# Altium project 22.99 TPF G2.PrjPcb
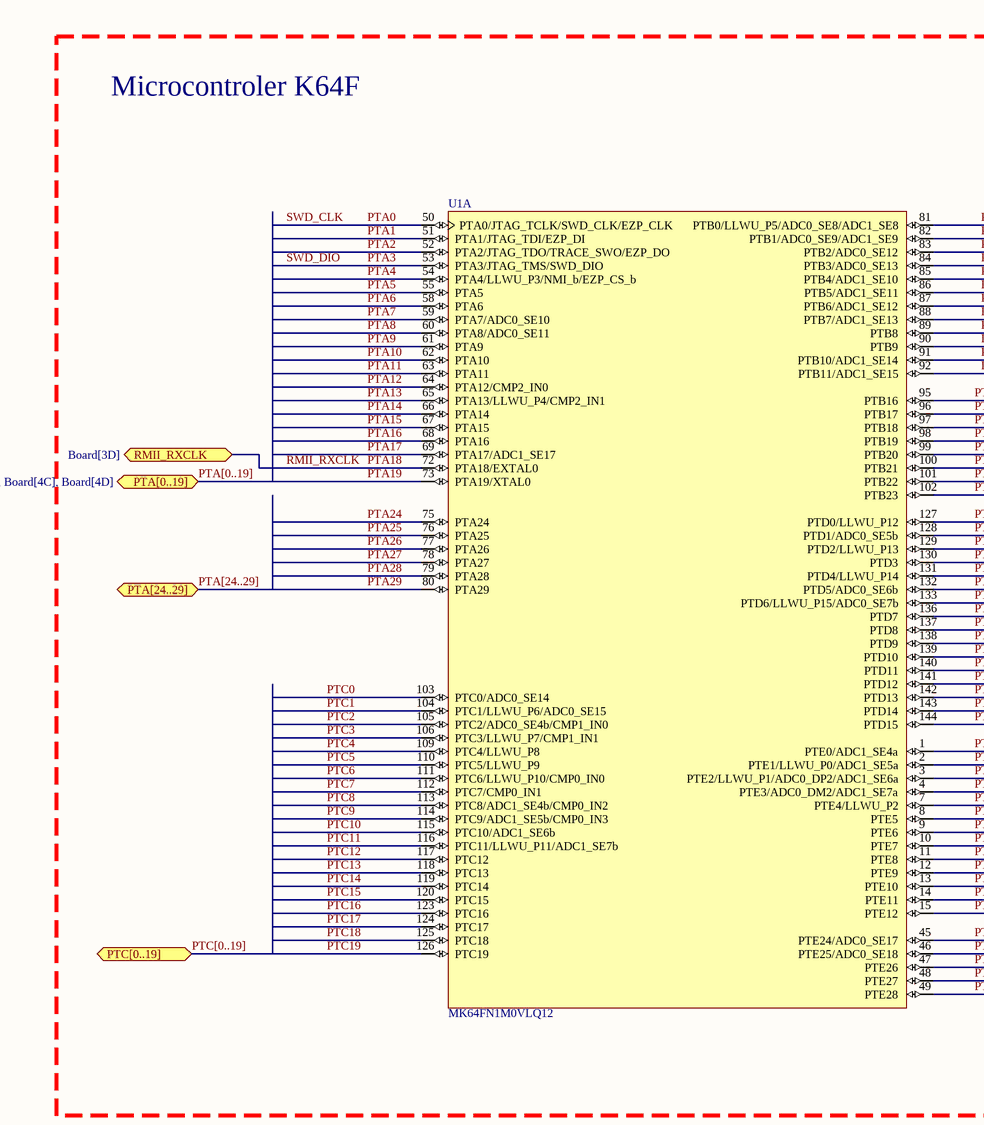
[diagram p0: Board.SchDoc, top left]
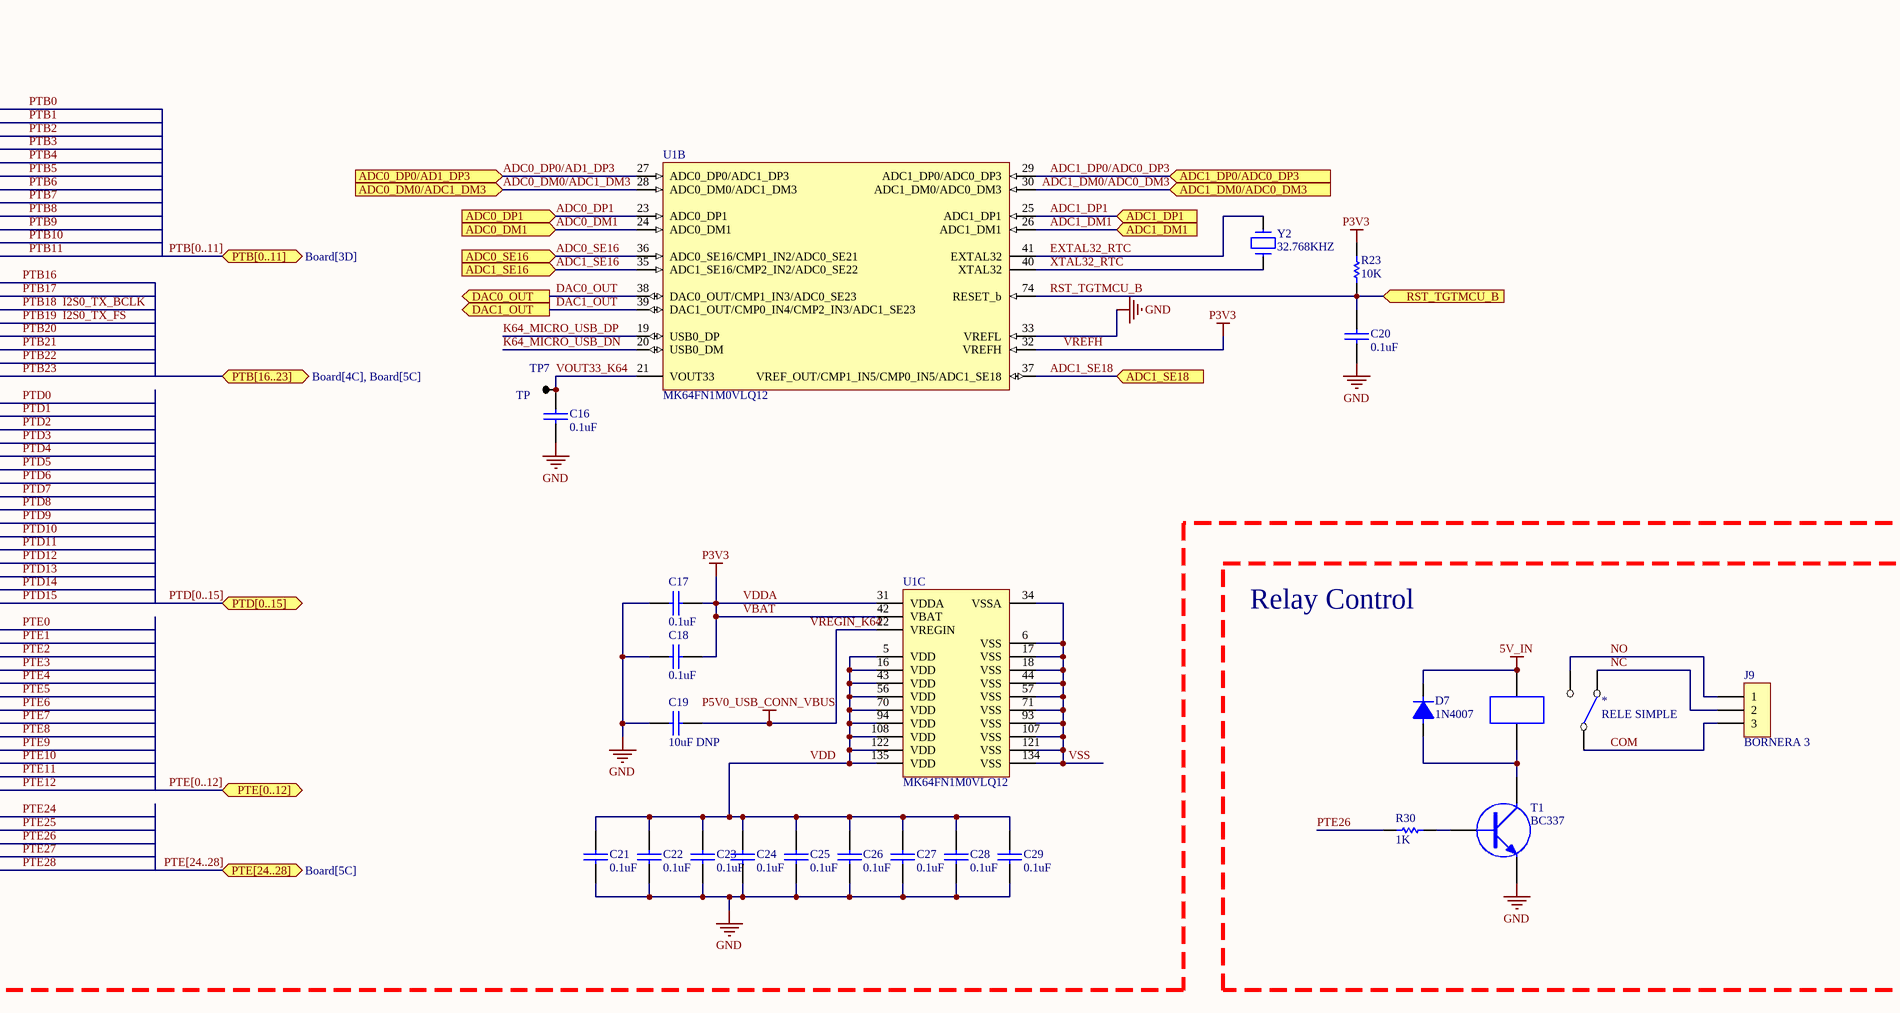
[diagram p1: Board.SchDoc, top right]
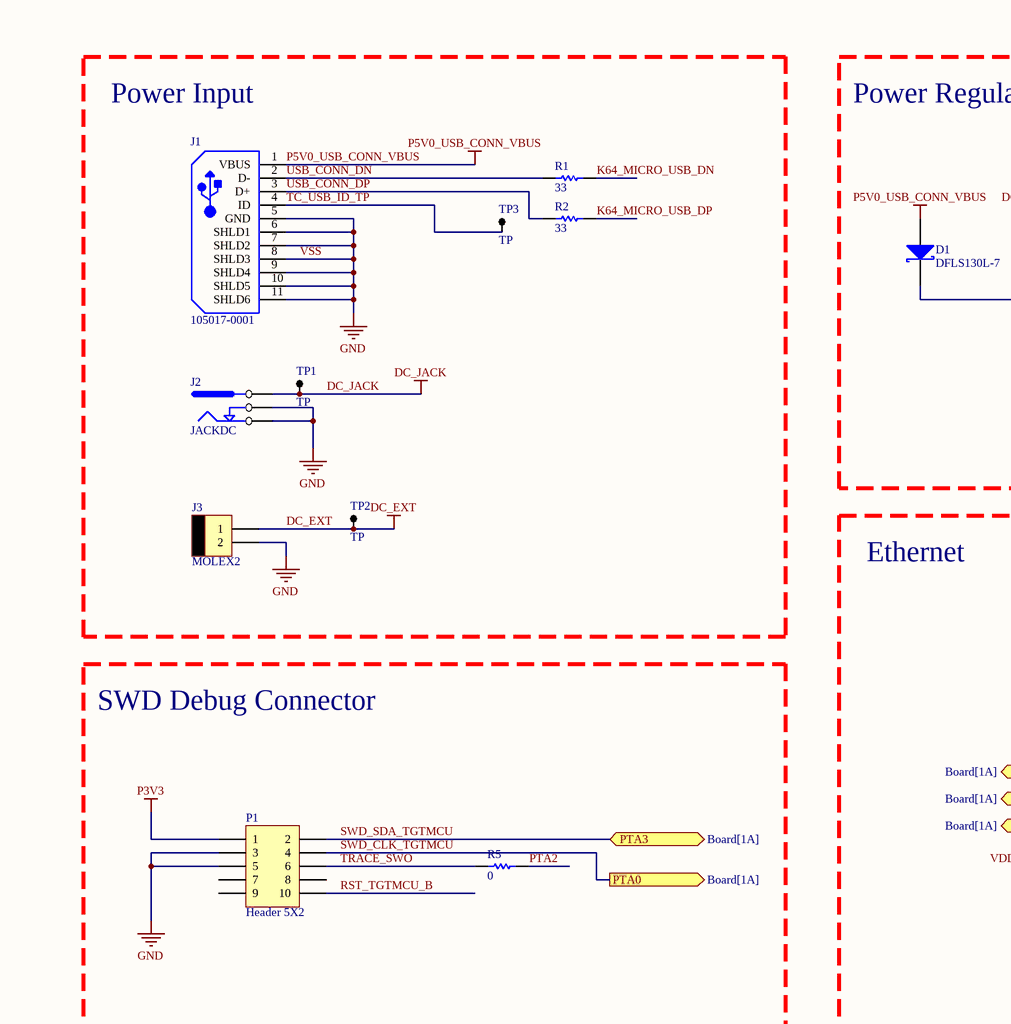
[diagram p2: Board.SchDoc, bottom left]
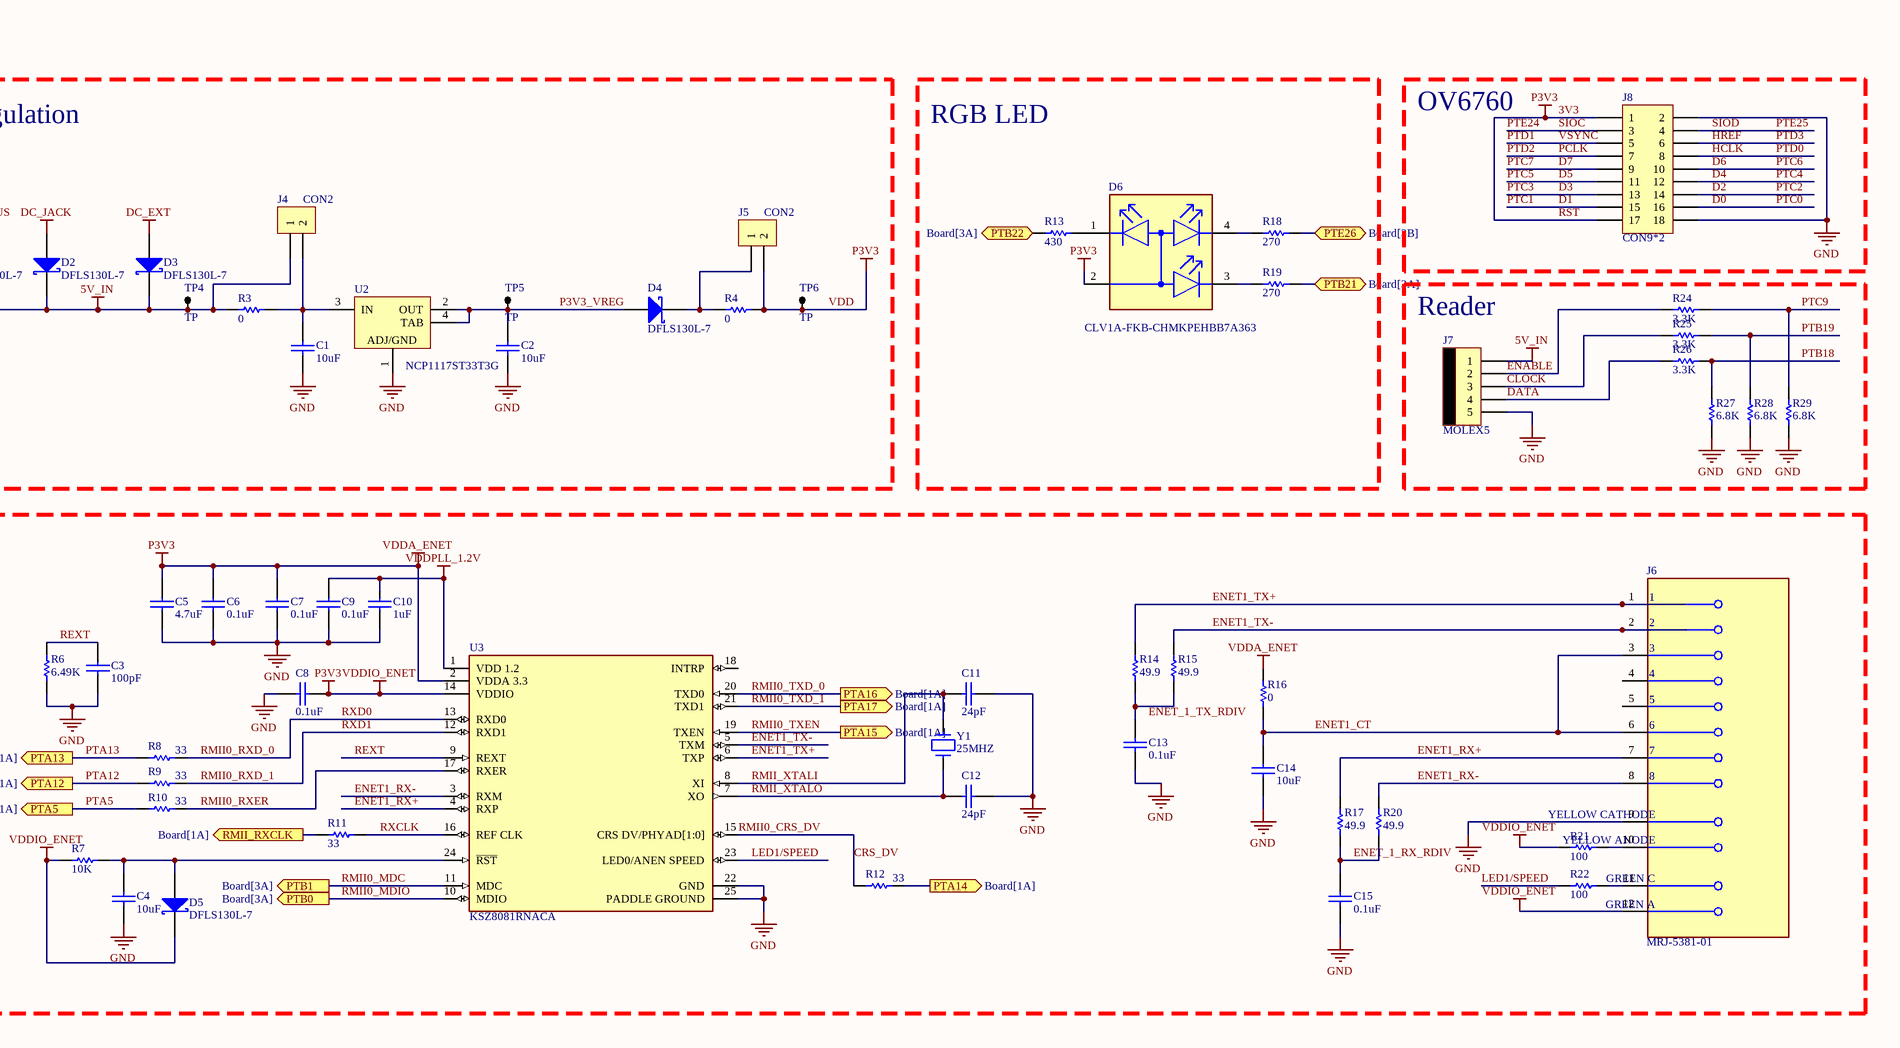
[diagram p3: Board.SchDoc, bottom right]
1 sheet, 90 parts. Net scope: flat (ports and power ports of the same name join across sheets).
Board file: Control Access.PcbDoc

## Sheet Board.SchDoc
size D; SheetNumber: 1; SheetTotal: 1; SPICEModelCacheWATEAUIU: <root> / <DocumentId>WATEAUIU</DocumentId> / </root>

### Parts
*  RELE SIMPLE  [RELE SERIE 964]
C1  10uF  [0805]
C2  10uF  [0805]
C3  100pF  [0805]
C4  10uF  [0805]
C5  4.7uF  [0805]
C6  0.1uF  [0805]
C7  0.1uF  [0805]
C8  0.1uF  [0805]
C9  0.1uF  [0805]
C10  1uF  [0805]
C11  24pF  [0805]
C12  24pF  [0805]
C13  0.1uF  [0805]
C14  10uF  [0805]
C15  0.1uF  [0805]
C16  0.1uF  [0805]
C17  0.1uF  [0805]
C18  0.1uF  [0805]
C19  10uF DNP  [1206]
C20  0.1uF  [0805]
C21  0.1uF  [0805]
C22  0.1uF  [0805]
C23  0.1uF  [0805]
C24  0.1uF  [0805]
C25  0.1uF  [0805]
C26  0.1uF  [0805]
C27  0.1uF  [0805]
C28  0.1uF  [0805]
C29  0.1uF  [0805]
D1  DFLS130L-7  [DIOD-POWERDI123-2_A_V]
D2  DFLS130L-7  [DIOD-POWERDI123-2_A_V]
D3  DFLS130L-7  [DIOD-POWERDI123-2_A_V]
D4  DFLS130L-7  [DIOD-POWERDI123-2_A_V]
D5  DFLS130L-7  [DIOD-POWERDI123-2_A_V]
D6  CLV1A-FKB-CHMKPEHBB7A363  [FP-CLV1A-FKB-CHMKPEHBB7A3-MFG]
D7  1N4007  [SMAK]
J1  105017-0001  [USB-MICRO-B_V]
J2  JACKDC  [JACKDC]
J3  MOLEX2  [MOLEX2]
J4  CON2  [SIP2]
J5  CON2  [SIP2]
J6  MRJ-5381-01  [FP-MRJ-5381-01-MFG]
J7  MOLEX5  [MOLEX5]
J8  CON9*2  [SIP9*2]
J9  BORNERA 3  [BORNERA3]
P1  Header 5X2  [HDR2X5]
R1  33  [0805]
R2  33  [0805]
R3  0  [0805]
R4  0  [0805]
R5  0  [0805]
R6  6.49K  [0805]
R7  10K  [0805]
R8  33  [0805]
R9  33  [0805]
R10  33  [0805]
R11  33  [0805]
R12  33  [0805]
R13  430  [0805]
R14  49.9  [0805]
R15  49.9  [0805]
R16  0  [0805]
R17  49.9  [0805]
R18  270  [0805]
R19  270  [0805]
R20  49.9  [0805]
R21  100  [0805]
R22  100  [0805]
R23  10K  [0805]
R24  3.3K  [0805]
R25  3.3K  [0805]
R26  3.3K  [0805]
R27  6.8K  [0805]
R28  6.8K  [0805]
R29  6.8K  [0805]
R30  1K  [0805]
T1  BC337  [SOT23]
TP1  TP  [TPTH]
TP2  TP  [TPTH]
TP3  TP  [TPTH]
TP4  TP  [TPTH]
TP5  TP  [TPTH]
TP6  TP  [TPTH]
TP7  TP  [TPTH]
U1  MK64FN1M0VLQ12  [918-03_N]  (parts A,B,C of 3)
U2  NCP1117ST33T3G  [ONSC-SOT-223-4-318H-01_A_V]
U3  KSZ8081RNACA  [FP-QFN44-24LD-PL-1-MFG]
Y1  25MHZ  [CRISTAL PERFIL]
Y2  32.768KHZ  [CRISTAL PERFIL]

### Blocks framed on the sheet
Microcontroler K64F: C16-C29 R23 TP7 U1 Y2
Relay Control: * D7 J9 R30 T1
Power Input: J1-J3 R1 R2 TP1-TP3
Power Regulation: C1 C2 D1-D4 J4 J5 R3 R4 TP4-TP6 U2
RGB LED: D6 R13 R18 R19
OV6760: J8
Reader: J7 R24-R29
Ethernet: C3-C15 D5 J6 R6-R12 R14-R17 R20-R22 U3 Y1
SWD Debug Connector: P1 R5

### Ports
ADC0_DM0/ADC1_DM3 (in), ADC0_DM1 (in), ADC0_DP0/AD1_DP3 (in), ADC0_DP1 (in), ADC0_SE16 (in), ADC1_DM0/ADC0_DM3 (in), ADC1_DM1 (in), ADC1_DP0/ADC0_DP3 (in), ADC1_DP1 (in), ADC1_SE16 (in), ADC1_SE18 (in), DAC0_OUT (out), DAC1_OUT (out), PTA0 (out, see Board[1A]), PTA3 (bidir, see Board[1A]), PTA5 (out, see Board[1A]), PTA12 (out, see Board[1A]), PTA13 (out, see Board[1A]), PTA14 (out, see Board[1A]), PTA15 (out, see Board[1A]), PTA16 (out, see Board[1A]), PTA17 (out, see Board[1A]), PTA[0..19] (bidir, see Board[2D], Board[4C], Board[4D]), PTA[24..29] (bidir), PTB0 (out, see Board[3A]), PTB1 (out, see Board[3A]), PTB21 (bidir, see Board[3A]), PTB22 (bidir, see Board[3A]), PTB[0..11] (bidir, see Board[3D]), PTB[16..23] (bidir, see Board[4C], Board[5C]), PTC[0..19] (bidir), PTD[0..15] (bidir), PTE26 (bidir, see Board[3B]), PTE[0..12] (bidir), PTE[24..28] (bidir, see Board[5C]), RMII_RXCLK (bidir, see Board[3D]), RMII_RXCLK (out, see Board[1A]), RST_TGTMCU_B (in)

### Nets
3V3: C5.2 C6.2 C7.2 C8.2 C17.2 C18.2 C21.2 C22.2 C23.2 C24.2 C25.2 C26.2 C27.2 C28.2 C29.2 D5.2(K) D6.2(COMMON_ANODE) J5.2 J6.12(GREEN_A) J8.1 J8.17 P1.1 R4.2 R7.1 R16.2 R21.1 R23.2 TP6.1 U1.5(VDD) U1.16(VDD) U1.31(VDDA) U1.32(VREFH) U1.42(VBAT) U1.43(VDD) U1.56(VDD) U1.70(VDD) U1.94(VDD) U1.108(VDD) U1.122(VDD) U1.135(VDD) U3.2(VDDA_3.3) U3.14(VDDIO)  [also labelled P3V3, RST, VBAT, VDD, VDDA, VDDA_ENET, VDDIO_ENET, VREFH]
5V_IN: *.B1 D1.2(K) D2.2(K) D3.2(K) D7.2 J4.1 J7.1 R3.1 TP4.1
DC_EXT: D3.1(A) J3.1 TP2.1
DC_JACK: D2.1(A) J2.1 TP1.1
P5V0_USB_CONN_VBUS: C19.1 D1.1(A) J1.1(VBUS) U1.22(VREGIN)
VDDPLL_1.2V: C9.2 C10.2 U3.1(VDD_1.2)
VSS: C1.2 C2.2 C3.1 C4.1 C5.1 C6.1 C7.1 C8.1 C9.1 C10.1 C11.1 C12.1 C13.1 C14.1 C15.1 C16.1 C17.1 C18.1 C19.2 C20.1 C21.1 C22.1 C23.1 C24.1 C25.1 C26.1 C27.1 C28.1 C29.1 J1.5(GND) J1.6(SHLD1) J1.7(SHLD2) J1.8(SHLD3) J1.9(SHLD4) J1.10(SHLD5) J1.11(SHLD6) J2.2 J2.3 J3.2 J6.9(YELLOW_CATHODE) J7.5 J8.2 J8.18 P1.3 P1.5 R6.1 R27.1 R28.1 R29.1 T1.3(E) U1.6(VSS) U1.17(VSS) U1.18(VSS) U1.33(VREFL) U1.34(VSSA) U1.44(VSS) U1.57(VSS) U1.71(VSS) U1.93(VSS) U1.107(VSS) U1.121(VSS) U1.134(VSS) U2.1(ADJ/GND) U3.22(GND) U3.25(PADDLE_GROUND)  [also labelled GND]
ADC0_DM0/ADC1_DM3: U1.28(ADC0_DM0/ADC1_DM3) ; port ADC0_DM0/ADC1_DM3
ADC0_DM1: U1.24(ADC0_DM1) ; port ADC0_DM1
ADC0_DP0/AD1_DP3: U1.27(ADC0_DP0/ADC1_DP3) ; port ADC0_DP0/AD1_DP3
ADC0_DP1: U1.23(ADC0_DP1) ; port ADC0_DP1
ADC0_SE16: U1.36(ADC0_SE16/CMP1_IN2/ADC0_SE21) ; port ADC0_SE16
ADC1_DM0/ADC0_DM3: U1.30(ADC1_DM0/ADC0_DM3) ; port ADC1_DM0/ADC0_DM3
ADC1_DM1: U1.26(ADC1_DM1) ; port ADC1_DM1
ADC1_DP0/ADC0_DP3: U1.29(ADC1_DP0/ADC0_DP3) ; port ADC1_DP0/ADC0_DP3
ADC1_DP1: U1.25(ADC1_DP1) ; port ADC1_DP1
ADC1_SE16: U1.35(ADC1_SE16/CMP2_IN2/ADC0_SE22) ; port ADC1_SE16
ADC1_SE18: U1.37(VREF_OUT/CMP1_IN5/CMP0_IN5/ADC1_SE18) ; port ADC1_SE18
CLOCK: J7.3 R25.2
COM: *.C1 J9.3
CRS_DV: R12.1 U3.15(CRS_DV/PHYAD[1:0])  [also labelled RMII0_CRS_DV]
D0: J8.16 U1.103(PTC0/ADC0_SE14)  [also labelled PTC0]
D1: J8.15 U1.104(PTC1/LLWU_P6/ADC0_SE15)  [also labelled PTC1]
D2: J8.14 U1.105(PTC2/ADC0_SE4b/CMP1_IN0)  [also labelled PTC2]
D3: J8.13 U1.106(PTC3/LLWU_P7/CMP1_IN1)  [also labelled PTC3]
D4: J8.12 U1.109(PTC4/LLWU_P8)  [also labelled PTC4]
D5: J8.11 U1.110(PTC5/LLWU_P9)  [also labelled PTC5]
D6: J8.10 U1.111(PTC6/LLWU_P10/CMP0_IN0)  [also labelled PTC6]
D7: J8.9 U1.112(PTC7/CMP0_IN1)  [also labelled PTC7]
DAC0_OUT: U1.38(DAC0_OUT/CMP1_IN3/ADC0_SE23) ; port DAC0_OUT
DAC1_OUT: U1.39(DAC1_OUT/CMP0_IN4/CMP2_IN3/ADC1_SE23) ; port DAC1_OUT
DATA: J7.4 R26.2
ENABLE: J7.2 R24.2
ENET1_CT: C14.2 J6.3 J6.6 R16.1
ENET1_RX+: J6.7 R17.2 U3.4(RXP)
ENET1_RX-: J6.8 R20.2 U3.3(RXM)
ENET1_TX+: J6.1 R14.2 U3.6(TXP)
ENET1_TX-: J6.2 R15.2 U3.5(TXM)
ENET_1_RX_RDIV: C15.2 R17.1 R20.1
EXTAL32_RTC: U1.41(EXTAL32) Y2.2
HCLK: J8.8 U1.127(PTD0/LLWU_P12)  [also labelled PTD0]
HREF: J8.6 U1.130(PTD3)  [also labelled PTD3]
I2S0_TX_BCLK: R26.1 R27.2 U1.97(PTB18)  [also labelled PTB18]
I2S0_TX_FS: R25.1 R28.2 U1.98(PTB19)  [also labelled PTB19]
K64_MICRO_USB_DN: R1.2 U1.20(USB0_DM)
K64_MICRO_USB_DP: R2.2 U1.19(USB0_DP)
LED1/SPEED: R22.1 U3.23(LED0/ANEN_SPEED)
NC: *.NC1 J9.2
NO: *.NA1 J9.1
P3V3_VREG: C2.1 D4.1(A) TP5.1 U2.2(OUT) U2.4(TAB)
PCLK: J8.7 U1.129(PTD2/LLWU_P13)  [also labelled PTD2]
PTA0: U1.50(PTA0/JTAG_TCLK/SWD_CLK/EZP_CLK)  [also labelled SWD_CLK]
PTA1: U1.51(PTA1/JTAG_TDI/EZP_DI)
PTA2: R5.2 U1.52(PTA2/JTAG_TDO/TRACE_SWO/EZP_DO)
PTA3: U1.53(PTA3/JTAG_TMS/SWD_DIO)  [also labelled SWD_DIO]
PTA4: U1.54(PTA4/LLWU_P3/NMI_b/EZP_CS_b)
PTA5: R10.1 U1.55(PTA5) ; port PTA5
PTA6: U1.58(PTA6)
PTA7: U1.59(PTA7/ADC0_SE10)
PTA8: U1.60(PTA8/ADC0_SE11)
PTA9: U1.61(PTA9)
PTA10: U1.62(PTA10)
PTA11: U1.63(PTA11)
PTA12: R9.1 U1.64(PTA12/CMP2_IN0) ; port PTA12
PTA13: R8.1 U1.65(PTA13/LLWU_P4/CMP2_IN1) ; port PTA13
PTA14: U1.66(PTA14)
PTA15: U1.67(PTA15)
PTA16: U1.68(PTA16)
PTA17: U1.69(PTA17/ADC1_SE17)
PTA18: R11.1 U1.72(PTA18/EXTAL0) ; port RMII_RXCLK  [also labelled RMII_RXCLK]
PTA19: U1.73(PTA19/XTAL0)
PTA24: U1.75(PTA24)
PTA25: U1.76(PTA25)
PTA26: U1.77(PTA26)
PTA27: U1.78(PTA27)
PTA28: U1.79(PTA28)
PTA29: U1.80(PTA29)
PTB0: U1.81(PTB0/LLWU_P5/ADC0_SE8/ADC1_SE8)
PTB1: U1.82(PTB1/ADC0_SE9/ADC1_SE9)
PTB2: U1.83(PTB2/ADC0_SE12)
PTB3: U1.84(PTB3/ADC0_SE13)
PTB4: U1.85(PTB4/ADC1_SE10)
PTB5: U1.86(PTB5/ADC1_SE11)
PTB6: U1.87(PTB6/ADC1_SE12)
PTB7: U1.88(PTB7/ADC1_SE13)
PTB8: U1.89(PTB8)
PTB9: U1.90(PTB9)
PTB10: U1.91(PTB10/ADC1_SE14)
PTB11: U1.92(PTB11/ADC1_SE15)
PTB16: U1.95(PTB16)
PTB17: U1.96(PTB17)
PTB20: U1.99(PTB20)
PTB21: U1.100(PTB21)
PTB22: U1.101(PTB22)
PTB23: U1.102(PTB23)
PTC8: U1.113(PTC8/ADC1_SE4b/CMP0_IN2)
PTC9: R24.1 R29.2 U1.114(PTC9/ADC1_SE5b/CMP0_IN3)
PTC10: U1.115(PTC10/ADC1_SE6b)
PTC11: U1.116(PTC11/LLWU_P11/ADC1_SE7b)
PTC12: U1.117(PTC12)
PTC13: U1.118(PTC13)
PTC14: U1.119(PTC14)
PTC15: U1.120(PTC15)
PTC16: U1.123(PTC16)
PTC17: U1.124(PTC17)
PTC18: U1.125(PTC18)
PTC19: U1.126(PTC19)
PTD1: J8.5 U1.128(PTD1/ADC0_SE5b)  [also labelled VSYNC]
PTD4: U1.131(PTD4/LLWU_P14)
PTD5: U1.132(PTD5/ADC0_SE6b)
PTD6: U1.133(PTD6/LLWU_P15/ADC0_SE7b)
PTD7: U1.136(PTD7)
PTD8: U1.137(PTD8)
PTD9: U1.138(PTD9)
PTD10: U1.139(PTD10)
PTD11: U1.140(PTD11)
PTD12: U1.141(PTD12)
PTD13: U1.142(PTD13)
PTD14: U1.143(PTD14)
PTD15: U1.144(PTD15)
PTE0: U1.1(PTE0/ADC1_SE4a)
PTE1: U1.2(PTE1/LLWU_P0/ADC1_SE5a)
PTE2: U1.3(PTE2/LLWU_P1/ADC0_DP2/ADC1_SE6a)
PTE3: U1.4(PTE3/ADC0_DM2/ADC1_SE7a)
PTE4: U1.7(PTE4/LLWU_P2)
PTE5: U1.8(PTE5)
PTE6: U1.9(PTE6)
PTE7: U1.10(PTE7)
PTE8: U1.11(PTE8)
PTE9: U1.12(PTE9)
PTE10: U1.13(PTE10)
PTE11: U1.14(PTE11)
PTE12: U1.15(PTE12)
PTE24: J8.3 U1.45(PTE24/ADC0_SE17)  [also labelled SIOC]
PTE25: J8.4 U1.46(PTE25/ADC0_SE18)  [also labelled SIOD]
PTE26: R30.2 U1.47(PTE26)
PTE27: U1.48(PTE27)
PTE28: U1.49(PTE28)
REXT: C3.2 R6.2 U3.9(REXT)
RMII0_MDC: U3.11(MDC) ; port PTB1
RMII0_MDIO: U3.10(MDIO) ; port PTB0
RMII0_RXD_0: R8.2 U3.13(RXD0)  [also labelled RXD0]
RMII0_RXD_1: R9.2 U3.12(RXD1)  [also labelled RXD1]
RMII0_RXER: R10.2 U3.17(RXER)
RMII0_TXD_0: U3.20(TXD0) ; port PTA16
RMII0_TXD_1: U3.21(TXD1) ; port PTA17
RMII0_TXEN: U3.19(TXEN) ; port PTA15
RMII_XTALI: C11.2 U3.8(XI) Y1.2
RMII_XTALO: C12.2 U3.7(XO) Y1.1
RST_TGTMCU_B: C20.2 P1.10 R23.1 U1.74(RESET_b) ; port RST_TGTMCU_B
RXCLK: R11.2 U3.16(REF_CLK)
SWD_CLK_TGTMCU: P1.4 ; port PTA0
SWD_SDA_TGTMCU: P1.2 ; port PTA3
TC_USB_ID_TP: J1.4(ID) TP3.1
TRACE_SWO: P1.6 R5.1
USB_CONN_DN: J1.2(D-) R1.1
USB_CONN_DP: J1.3(D+) R2.1
VOUT33_K64: C16.2 TP7.1 U1.21(VOUT33)
XTAL32_RTC: U1.40(XTAL32) Y2.1
Net*_B2: *.B2 D7.1 T1.2(C)
NetC1_1: C1.1 J4.2 R3.2 U2.3(IN)
NetC4_2: C4.2 D5.1(A) R7.2 U3.24(~{RST})
NetC13_2: C13.2 R14.1 R15.1
NetD4_2: D4.2(K) J5.1 R4.1
NetD6_1: D6.1(RED(C)) R13.2
NetD6_3: D6.3(BLUE(C)) R19.1
NetD6_4: D6.4(GREEN(C)) R18.1
NetJ6_10: J6.10(YELLOW_ANODE) R21.2
NetJ6_11: J6.11(GREEN_C) R22.2
NetR12_2: R12.2 ; port PTA14
NetR13_1: R13.1 ; port PTB22
NetR18_2: R18.2 ; port PTE26
NetR19_2: R19.2 ; port PTB21
NetR30_1: R30.1 T1.1(B)

Not connected (* = marked no-connect by the designer): J6 4 5; P1 7 8 9; U3 18(INTRP)

### Buses and harness runs
bus PTA[0..19] = port PTA[0..19]
bus PTA[24..29] = port PTA[24..29]
bus PTB[0..11] = port PTB[0..11]
bus PTC[0..19] = port PTC[0..19]
bus PTD[0..15] = port PTD[0..15]
bus PTE[0..12] = port PTE[0..12]
bus PTE[24..28] = port PTE[24..28]

### Notes on the sheet
- Labels drawn without touching a wire or pin: ENET_1_TX_RDIV, VREGIN_K64

### Library data of the parts
C1-C29 = CAP
D1-D5 = CMP-2000-07448-1: Schottky Barrier Rectifier, 30 V, 1 A, -40 to 125 degC, 2-Pin SMD, RoHS, Tape and Reel; Manufacturer: Diodes Inc; Max Repetitive Reverse Voltage (Vrrm): 30V; Polarity: Standard; Average Rectified Current: 1A; Element Configuration: Single; Forward Voltage: 360mV; Peak Non-Repetitive Surge Current: 50A; Max Power Dissipation: 1.67W; Case\/Package: SMD/SMT; Capacitance: 76pF; Peak Reverse Current: 1mA; Datasheet URL: https://www.diodes.com/assets/Datasheets/ds30492.pdf; Package Quantity: 3000; Reverse Voltage (DC): 30V; Package Reference: POWERDI123-2_A; Lead Free: LeadFree; Mounting Technology: SurfaceMount; Max Operating Temperature: 125degC; Current Rating: 1A; Radiation Hardening: No; Width: 1.78mm; Height: 0.98mm; Output Current: 1A; Contact Plating: Matte; Length: 2.8mm; Number of Pins: 2; Voltage Rating (DC): 30V; RoHSCompliant: true; Termination: SMD/SMT; Forward Current: 1A; Min Operating Temperature: -40degC; Datasheet Version: Rev. 4-2, 06/2009; Packaging: TapeandReel; REACH SVHC: NoSVHC; Max Forward Surge Current (Ifsm): 50A; Manufacturer URL: http://www.diodes.com/; Mount: SurfaceMount; Package Description: 2-Pin Small Outline Diode, Body 2.8 x 1.78 mm
D6 = CMP-13977-000017-1: LED RGB 4PLCC SMD; Lens Color: White; Number of Elements: 3; Dominant Wavelength: 470nm; Forward Voltage: 3.2V; Luminous Intensity: 315mcd; Lens Style: Round; Viewing Angle: 120°; Number of LEDs: 1; Test Current: 20mA; Lens Transparency: Diffused; Reverse Voltage: 5V; Color: Blue; Height: 2.1mm; Package Quantity: 2000; Length: 2.8mm; Number of Pins: 4; Packaging: Tape and Reel; Width: 2.8mm; Radiation Hardening: No; Depth: 3.2mm; Mount: Surface Mount; Min Operating Temperature: -40°C; Forward Current: 20mA; Max Operating Temperature: 100°C; Case/Package: PLCC
D7 = DIODO
J1 = CMP-2000-05827-1: Micro-USB B Receptacle, Right Angle, Bottom Mount, Surface Mount, with Solder Tabs, -30 to 85 degC, 5-Pin USB, RoHS, Tape and Reel; Manufacturer: Molex; Featured Product: Micro-USBConnectorsUSBConnectors; Other Names: WM1399DKR; Package Version: Rev. F, 12/2012; Number of Contacts: 5; Connector Type: USB-microB; Catalog Drawings: 1050170001; 3D Model: 105017-0001.stp; Mating Products: WM17145-ND-CABLEMICROUSBBTOSTDA1.0MWM17147-ND-CABLEMICROUSBBTOSTDA2.0MWM17146-ND-CABLEMICROUSBBTOSTDA1.5M; PCN Assembly/Origin: ResinSupplier21/Oct/2015; Voltage - Max: 30V; Online Catalog: Molex-MicroUSB; Manufacturer URL: http://www.molex.com/; Package Description: 5-Leads USB, Micro B, Body 7.5 x 5 mm, Pitch 0.65 mm; Datasheet URL: http://www.molex.com/elqNow/elqRedir.htm?ref=http://www.molex.com/webdocs/datasheets/pdf/en-us/1050170001_IO_CONNECTORS.pdf; Ingress Protection: -; Datasheet Version: 03/2016; Mounting Type: BoardCutout,SurfaceMount,RightAngle; Circuits: 5; Standard Package: 1; Package Reference: MICRO-B; Package URL: http://www.molex.com/pdm_docs/sd/1050170001_sd.pdf; Category: Connectors,Interconnects; Series: -; RoHS Information: 1050170001CertofCompliance; Features: Shielded,SolderRetention; Family: USB,DVI,HDMIConnectors; Specifications: -; Gender: Receptacle; Packaging: Digi-Reel®; Mounting Technology: SurfaceMount
J6 = CMP-2000-06754-2: CONN MOD JACK 8P8C R/A UNSHLD; Voltage Rating (DC): 100V; Number of Positions Loaded: 8; Ratings: IP67; Shielding: Unshielded; Pitch: 2.54mm; Gender: Female; Direction: Down; Current Rating: 1.5A; Number of Ports: 1; Primary Type: MODULAR; Contact Resistance: 30mR; Contact Material: Bronze; Radiation Hardening: No; Max Operating Temperature: 105°C; Mount: Through Hole; Connector Type: Jack; Housing Material: PC; RoHS Compliant: Yes; Series: MRJ; Number of Contacts: 8; Packaging: Bulk; Contact Plating: Gold; Color: Black; Depth: 26.95mm; Voltage Rating: 100V; Termination: Through Hole; Lead Free: Lead Free; Number of Positions: 8; Orientation: Right Angle; Min Operating Temperature: -40°C; Flammability Rating: UL94 V-0; Number of Rows: 1; Length: 30.3mm; Max Current Rating: 1.5A; Package Quantity: 40; Housing Color: Black
P1 = Header 5X2: Header, 5-Pin, Dual row; LatestRevisionDate: 17-Jul-2002; LatestRevisionNote: Re-released for DXP Platform.; Publisher: Altium Limited
R1-R30 = RES
T1 = TRANSISTOR NPN
U1 = CMP-0182-00046-1: Cortex-M4-based Microcontroller with FPU, 1 MB, 120 MHz, 1.71 to 3.6 V, -40 to 105 degC, 144-Pin QFP (918-03), RoHS, Tray; Manufacturer: Freescale Semiconductor; SRAM: 256 KB; Flash: 1 MB; ComponentLink2URL: http://cache.freescale.com/files/microcontrollers/doc/data_sheet/K64P144M120SF5.pdf?pspll=1; VDD: 1.71 to 3.6 V; PackageDescription: 144-Pin Plastic Quad Flat Package, Body 20 x 20 mm, Pitch 0.5 mm; Temperature Range: -40 to 105 degC; ComponentLink1URL: http://www.freescale.com/; ComponentLink3Description: Package Specification; PartNumber: MK64FN1M0VLQ12; VBAT: 1.71 to 3.6 V; ComponentLink1Description: Manufacturer URL; ComponentLink3URL: http://cache.freescale.com/files/shared/doc/package_info/98ASS23177W.pdf; DatasheetVersion: Rev. 3; PackageVersion: Rev. G; RoHS: TRUE; Mounting Technology: Surface Mount; Packing: Tray; VDDA: 1.71 to 3.6 V; ComponentLink2Description: Datasheet
U2 = CMP-1679-00010-1: Low-Dropout Positive Fixed Voltage Regulator, 1 A, 3.3 V Output Voltage, 0 to 125 degC, 4-Pin SOT-223 (318H-01), Pb-Free, Tape and Reel; Resistance: 220 kohm; Type (Resistor): Thick Film; Voltage Rating: 75 V; Tolerance: 1%; Case\Package: 0603; Power Rating: 100 mW; Width: 0.85 mm; Weight: 7.1E-05 oz; ComponentLink2URL: http://www.onsemi.com/pub_link/Collateral/NCP1117-D.PDF; RoHSCompliant: true; Height: 0.45 mm; PackageDescription: 4-Pin Small Outline Transistor, Body 6.5 x 3.5 mm, Pitch 2.3 mm; ComponentLink1Description: Manufacturer URL; ComponentLink1URL: http://www.onsemi.com/; PackageReference: SOT-223-4-318H-01_A; Max Operating Temperature: 155 degC; Packaging: Tape and Reel; REACH SVHC: Unknown; Length: 1.55 mm; Package Quantity: 5000; Radiation Hardening: No; Min Operating Temperature: -55 degC; DatasheetVersion: Rev. 27, 09/2014; Mount: Surface Mount; Case Code (Imperial): 0603; Case Code (Metric): 1608; ComponentLink2Description: Datasheet
U3 = CMP-06281-000014-1: IC TRANSCEIVER FULL 1/1 24QFN; Manufacturer: Microchip; Standoff Height: 0.02mm; Max Junction Temp: +125°C; Data Rate: 100Mbits/s; Simplex Duplex: Full Duplex; Number Of Channels: 1; Min Supply Voltage: 1.71V; Max Supply Voltage: 3.465V; Nominal Supply Current: 20-47mA; Interface: Ethernet,Other; Manufacturer Part Number: KSZ8081RNACA; Device Class L3: Ethernet Interface ICs; ComponentLink2Description: Datasheet; Ambient Temperature Range High: +70°C; Ambient Temperature Range Low: 0°C; Octopart: https://octopart.com/ksz8081rnaca-microchip-66799959; Device Class L1: Integrated Circuits (ICs); Package: QFN44-24LD-PL-1; Digikey Description: IC TRANSCEIVER FULL 1/1 24QFN; Category: IC; RoHS: TRUE; Automotive: No; ComponentLink2URL: http://ww1.microchip.com/downloads/en/DeviceDoc/KSZ8081RNA-RND-10BASE-T-100BASE-TX-PHY-with-RMII-Support-DS00002199B.pdf; Lead Free: Yes; Height: 0.9mm; Temperature Range High: +125°C; Temperature: to +125°C; Device Class L2: Interface ICs
Y1 Y2 = CRISTAL